# EAGLE design LEVELSHIFTER_REV01 (EAGLE 9.2.2)
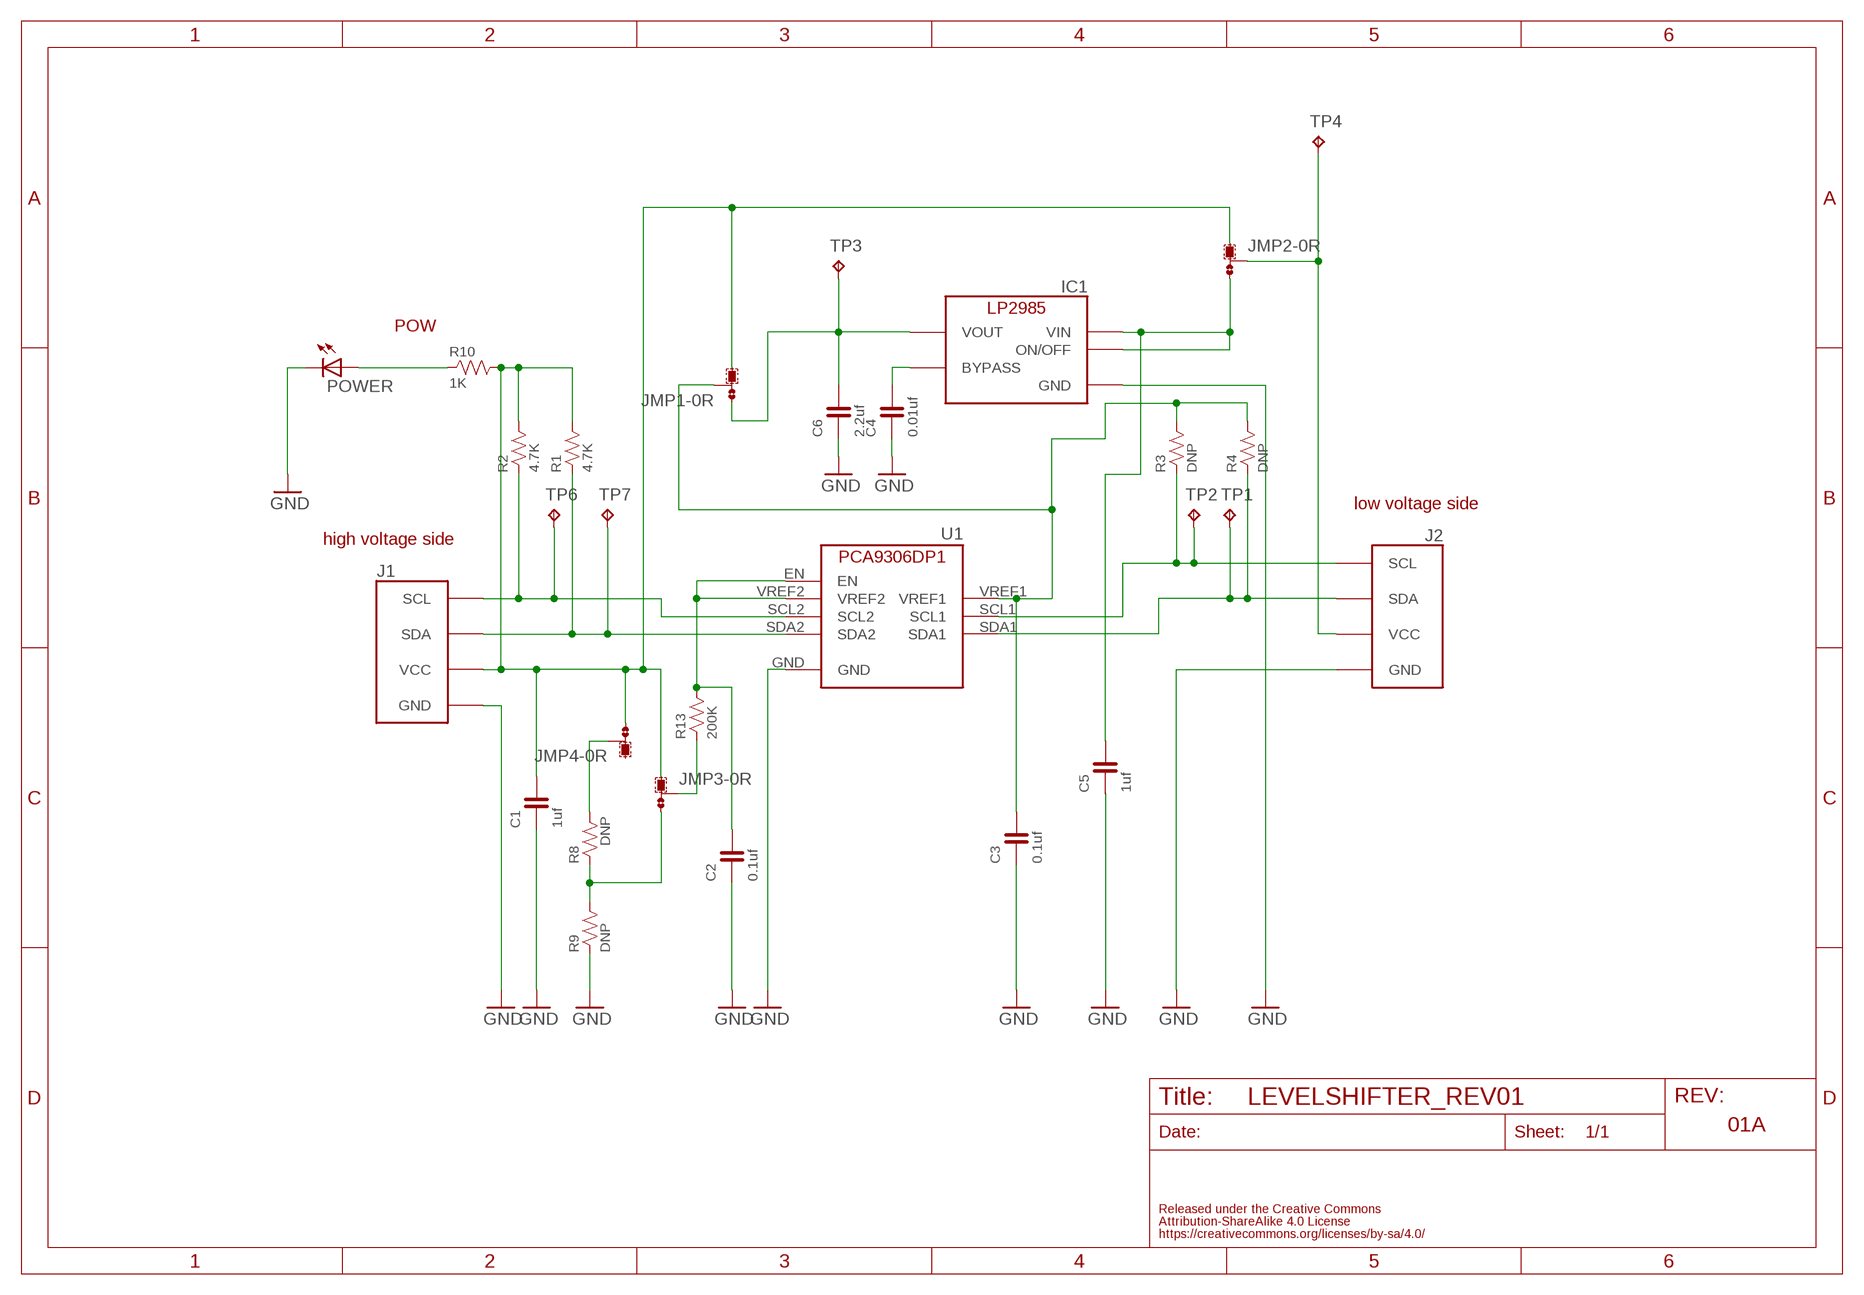
[diagram p0: schematic, sheet 1]

## Parts
C1  1uf  CAPACITOR-0603  [0603]
C2  0.1uf  CAPACITOR-0603  [0603]
C3  0.1uf  CAPACITOR-0603  [0603]
C4  0.01uf  CAPACITOR-0603  [0603]
C5  1uf  CAPACITOR-0603  [0603]
C6  2.2uf  CAPACITOR-0603  [0603]
IC1  LP2985-33DBV  [SOT-23-5]
J1  FABO_BRICK_I2C-S04B-PASK-2  [FABO_BRICK_I2C_S04B-PASK-2]
J2  FABO_BRICK_I2C-S04B-PASK-2  [FABO_BRICK_I2C_S04B-PASK-2]
JMP1  0R-JUMPA  [A0R-JMP]
JMP2  0R-JUMPA  [A0R-JMP]
JMP3  0R-JUMPA  [A0R-JMP]
JMP4  0R-JUMPA  [A0R-JMP]
POWER  LEDCHIPLED_0603  [CHIPLED_0603]
R1  4.7K  RESISTOR-0603  [0603]
R2  4.7K  RESISTOR-0603  [0603]
R3  DNP  RESISTOR-0603  [0603]
R4  DNP  RESISTOR-0603  [0603]
R8  DNP  RESISTOR-0603  [0603]
R9  DNP  RESISTOR-0603  [0603]
R10  1K  RESISTOR-0603  [0603]
R13  200K  RESISTOR-0603  [0603]
TP1  TPTP11R  [TP11R]
TP2  TPTP11R  [TP11R]
TP3  TPTP11R  [TP11R]
TP4  TPTP11R  [TP11R]
TP6  TPTP11R  [TP11R]
TP7  TPTP11R  [TP11R]
U1  PCA9306DP1  [TSSOP8]

## Nets
GND: C1.1 C2.1 C3.1 C4.1 C5.1 C6.1 IC1.2(GND) J1.GND J2.GND POWER.C R9.1 U1.GND
N$1: J1.SDA R1.1 TP7.TP U1.SDA2
N$2: J1.SCL R2.1 TP6.TP U1.SCL2
N$3: C2.2 R13.2 U1.EN U1.VREF2
N$4: JMP3.3 R8.1 R9.2
N$7: J2.SCL R3.1 TP2.TP U1.SCL1
N$8: J2.SDA R4.1 TP1.TP U1.SDA1
N$9: C3.2 JMP1.2 R3.2 R4.2 U1.VREF1
N$10: C5.2 IC1.1(VIN) IC1.3(ON/OFF) JMP2.3
N$13: JMP4.2 R8.2
N$18: C6.2 IC1.5(VOUT) JMP1.1 TP3.TP
N$19: JMP3.2 R13.1
N$20: C4.2 IC1.4(BYPASS)
N$21: J2.VCC JMP2.2 TP4.TP
N$27: POWER.A R10.1
VCC: C1.2 J1.VCC JMP1.3 JMP2.1 JMP3.1 JMP4.3 R1.2 R2.2 R10.2
Unconnected: JMP4.1

## Notes on the sheet
- POW
- low voltage side
- high voltage side
- 01A

## Library data of the parts
C1-C6 = FaBo-Capacitor:CAPACITOR: CAPACITOR
IC1 = FaBo-Supply:LP2985: LP2985
J1 J2 = FaBo-Template 2:FABO_BRICK_I2C: FaBo Brick I2C
JMP1-JMP4 = jump-0r-smd:0R-JUMP: SMD 0R 0805 Jumper
POWER = led:LED: LED OSRAM: - CHIPLED LG R971, LG N971, LY N971, LG Q971, LY Q971, LO R971, LY R971 LH N974, LH R974 LS Q976, LO Q976, LY Q976 LO Q996 - Hyper CHIPLED LW Q18S LB Q993, LB Q99A, LB R99A - SideLED LS A670, LO A670, LY A670, LG A670, LP A670 LB A673, LV A673, LT A673, LW A673 LH A674 LY A675 LS A676, LA A676, LO A676, LY A676, LW A676 LS A679, LY A679, LG A679 - Hyper Micro SIDELED® LS Y876, LA Y876, LO Y876, LY Y876 LT Y87S - SmartLED LW L88C, LW L88S LB L89C, LB L89S, LG L890 LS L89K, LO L89K, LY L89K LS L896, LA L896, LO L896, LY L896 - TOPLED LS T670, LO T670, LY T670, LG T670, LP T670 LSG T670, LSP T670, LSY T670, LOP T670, LYG T670 LG T671, LOG T671, LSG T671 LB T673, LV T673, LT T673, LW T673 LH T674 LS T676, LA T676, LO T676, LY T676, LB T676, LH T676, LSB T676, LW T676 LB T67C, LV T67C, LT T67C, LS T67K, LO T67K, LY T67K, LW E67C LS E67B, LA E67B, LO E67B, LY E67B, LB E67C, LV E67C, LT E67C LW T67C LS T679, LY T679, LG T679 LS T770, LO T770, LY T770, LG T770, LP T770 LB T773, LV T773, LT T773, LW T773 LH T774 LS E675, LA E675, LY E675, LS T675 LS T776, LA T776, LO T776, LY T776, LB T776 LHGB T686 LT T68C, LB T68C - Hyper Mini TOPLED® LB M676 - Mini TOPLED Santana® LG M470 LS M47K, LO M47K, LY M47K Source: http://www.osram.convergy.de LUXEON: - LUMILED® LXK2-PW12-R00, LXK2-PW12-S00, LXK2-PW14-U00, LXK2-PW14-V00 LXK2-PM12-R00, LXK2-PM12-S00, LXK2-PM14-U00 LXK2-PE12-Q00, LXK2-PE12-R00, LXK2-PE12-S00, LXK2-PE14-T00, LXK2-PE14-U00 LXK2-PB12-K00, LXK2-PB12-L00, LXK2-PB12-M00, LXK2-PB14-N00, LXK2-PB14-P00, LXK2-PB14-Q00 LXK2-PR12-L00, LXK2-PR12-M00, LXK2-PR14-Q00, LXK2-PR14-R00 LXK2-PD12-Q00, LXK2-PD12-R00, LXK2-PD12-S00 LXK2-PH12-R00, LXK2-PH12-S00 LXK2-PL12-P00, LXK2-PL12-Q00, LXK2-PL12-R00 Source: www.luxeon.com KINGBRIGHT: KA-3528ASYC Source: www.kingbright.com
R1-R4 R8-R10 R13 = FaBo-Resistors:RESISTOR: RESISTOR
TP1-TP4 TP6 TP7 = testpad:TP: Test pad
U1 = FaBo-LevelTranslator:PCA9306DP1

## Board
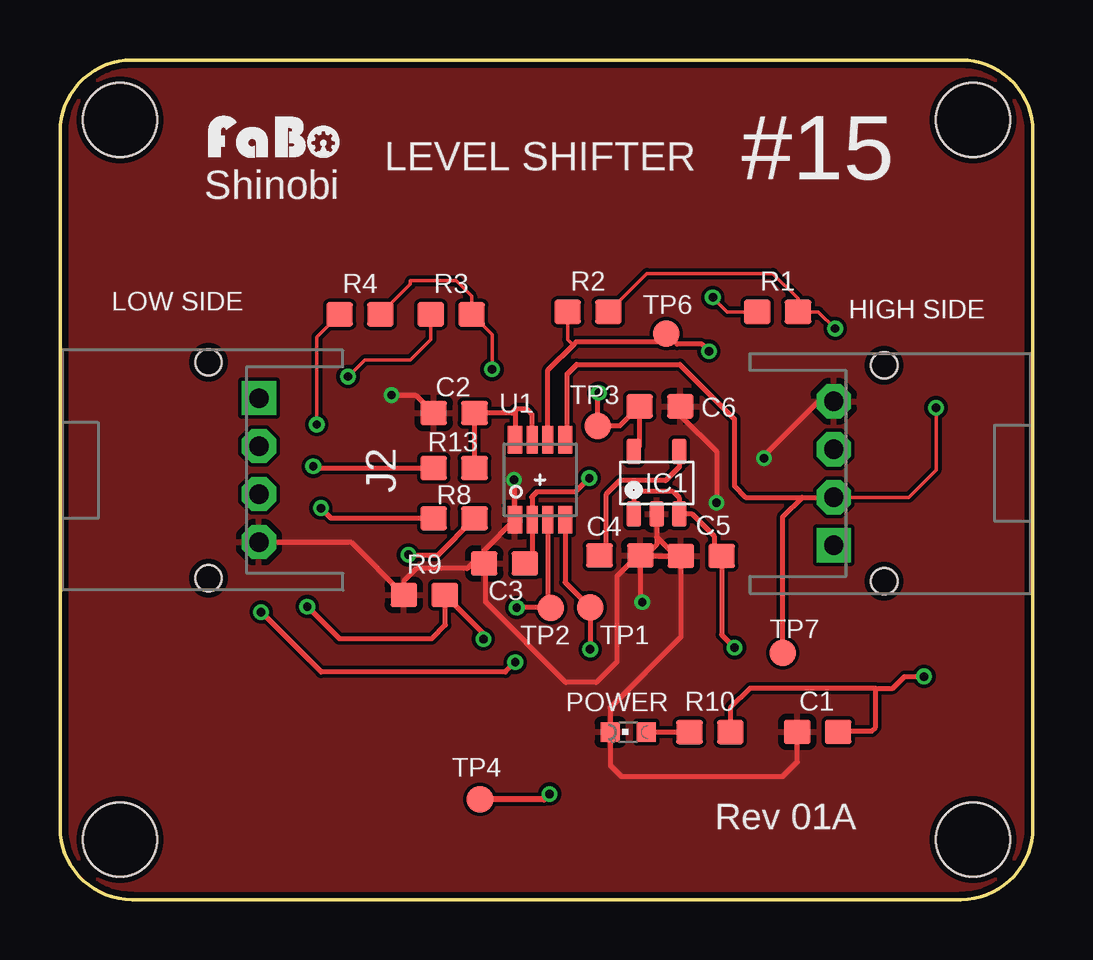
[diagram p1: board, top side]
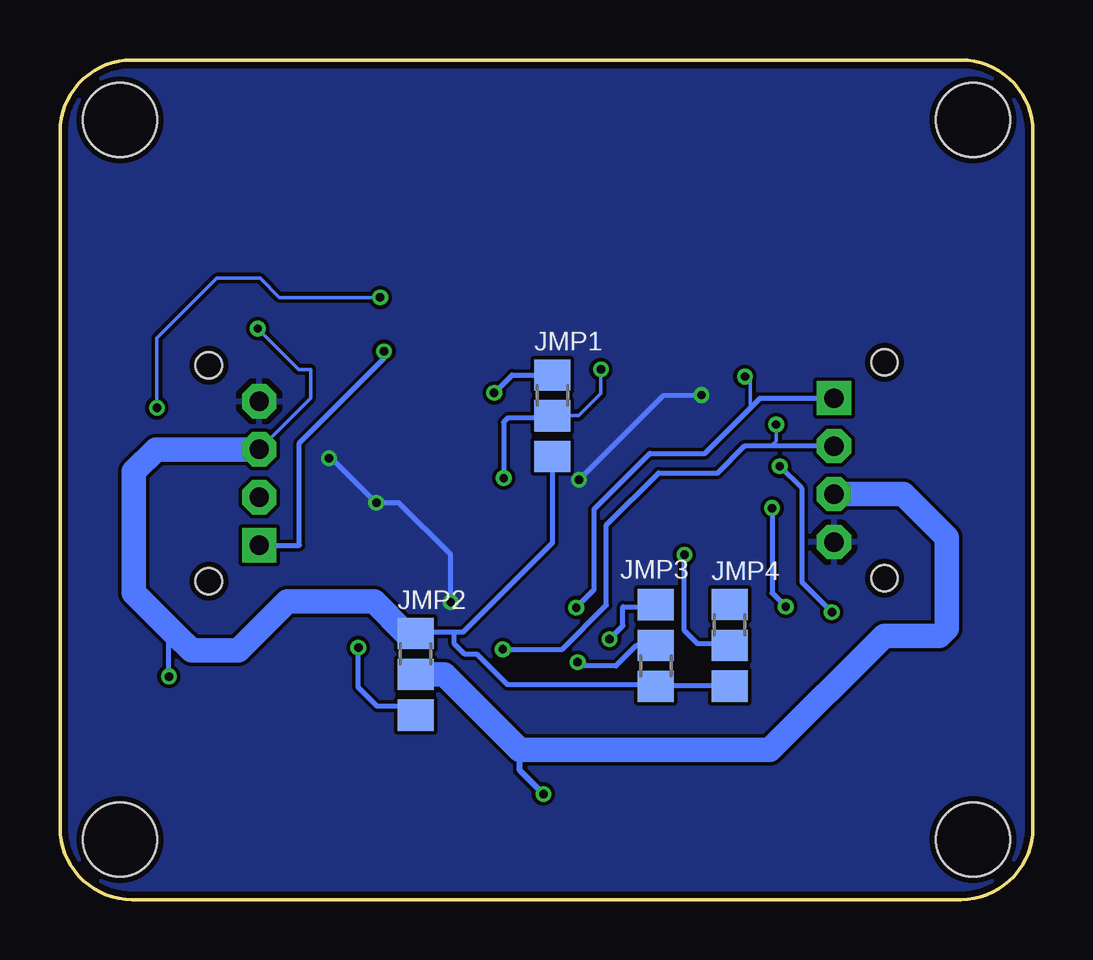
[diagram p2: board, bottom side, seen from below]

Size 40.54 x 35 mm. Coordinates in mm from the lower left corner, seen from the top.
Copper layers (1*16): Top 0.035mm / dielectric 1.5mm / Bottom 0.035mm
Design rules "SeeedStudio_2layer_DRU_no_angle_20140221": minimum track width 6mil, minimum drill 12mil, track to track 6mil, track to pad 6mil, pad to pad 6mil, via to via 6mil, smd to smd 0mil, copper to edge 10mil, drill to drill 10mil, minimum pad ring 10mil, minimum via ring 6mil, stop-mask expansion 2mil, vias tented up to drill 100mil, thermal gap 10mil

### Footprints (pad centres in the part's own frame; a part is rotated, then mirrored left to right if it is on the bottom)
0603 = smd 1.1 x 1: 1 -0.85,0; 2 0.85,0
SOT-23-5 = smd 0.6 x 1.05: 1 -0.95,-1.3; 2 0,-1.3; 3 0.95,-1.3; 4 0.95,1.3; 5 -0.95,1.3
FABO_BRICK_I2C_S04B-PASK-2 = drill 0.8 pad 1.422 octagon: GND -3,0; SDA 1,0; VCC -1,0 | drill 0.8 pad 1.422 square: SCL 3,0 | hole 1.1: 4.5,2.1; -4.5,2.1
A0R-JMP = smd 1.5 x 1.3: 1 0,1.7; 2 0,0; 3 0,-1.7
CHIPLED_0603 = smd 0.8 x 0.8: A 0,-0.75; C 0,0.75
TP11R = smd 1.1 x 1.1: TP 0,0
TSSOP8 = smd 0.6 x 1.15: EN -1.05,1.663; GND -1.05,-1.663; SDA1 1.05,-1.663; SDA2 1.05,1.663 | smd 0.45 x 1.15: SCL1 0.325,-1.663; SCL2 0.325,1.663; VREF1 -0.325,-1.663; VREF2 -0.325,1.663
FABO-SHINOBI = hole 3.1: 2.5,32.5; 38.04,32.5; 38.04,2.5; 2.5,2.5

### Placement (x,y rotation side)
C1  31.57,6.99 0 top
C2  16.42,20.28 0 top
C3  18.52,14.01 0 top
C4  23.33,14.34 180 top
C5  26.72,14.32 0 top
C6  25,20.56 180 top
IC1  24.86,17.37 0 top
J1  32.24,17.77 270 top
J2  8.29,17.9 90 top
JMP1  20.02,20.17 0 bottom
JMP2  25.72,9.39 0 bottom
JMP3  15.71,10.59 180 bottom
JMP4  12.64,10.6 0 bottom
POWER  23.68,6.98 90 top
R1  29.9,24.5 0 top
R2  22,24.5 0 top
R3  16.3,24.4 0 top
R4  12.5,24.4 0 top
R8  16.42,15.89 0 top
R9  15.18,12.7 0 top
R10  27.08,6.98 0 top
R13  16.42,17.99 0 top
TP1  22.1,12.17 0 top
TP2  20.45,12.15 0 top
TP3  22.41,19.74 0 top
TP4  17.5,4.17 0 top
TP6  25.26,23.6 0 top
TP7  30.12,10.29 0 top
U1  20,17.5 0 top
U$1  [LOGO_FABO_S]  8.97,30.77 0 top
U$2  [FABO-SHINOBI]  0,0 0 top

### Tracks (layer width: path | path; a pad name or v marks a point on that pad's centre or on a via)
GND  (via drill 0.35)
  Top 0.2: C4.1 24.2,14.32 24.39,14.32 | 24.39,14.32 25.65,14.32 | 25.65,14.32 C5.1 25.87,10.95 22.92,8 POWER.C 22.93,5.59 23.39,5.13 30.12,5.13 30.72,5.73 C1.1 | IC1.2 24.86,14.79 24.39,14.32 | IC1.2 24.86,15.11 25.65,14.32 | C6.1 25.85,20.18 27.36,18.67 v27.36,16.54 | 24.86,16.29 IC1.2 | C3.1 17.42,14.26 16.96,13.8 14.85,13.8 14.33,13.28 R9.1 12.13,14.9 J2.GND | C3.1 17.67,14.56 U1.GND 18.95,17.46 v18.92,17.5 | v29.33,18.39 29.33,18.5 31.6,20.77 J1.GND | C4.1 24.18,12.48 v24.26,12.4 | v13.81,21.03 14.82,21.03 C2.1 | C4.1 24.07,14.34 23.2,13.47 23.2,9.91 22.34,9.05 21.08,9.05 17.73,12.4 17.73,13.95 C3.1
  Bottom 0.2: v29.33,18.39 29.21,18.39 v27.36,16.54 26.42,16.54 24.26,14.38 v24.26,12.4 | v18.92,17.5 15.38,21.03 v13.81,21.03
  pour Bottom: 0.2,35.6 40.6,35.6 40.6,-0.4 0.2,-0.4
  pour Top: 0.2,35.6 40.6,35.6 40.6,-0.4 0.2,-0.4
N$1  (via drill 0.35)
  Top 0.152: R1.1 27.8,24.5 v27.2,25.1 | v36.5,20.5 36.5,17.9 35.37,16.77 32.2,16.77
  Top 0.2: U1.SDA2 21.13,19.24 21.13,21.91 21.53,22.31 25.83,22.31 28.1,20.04 28.1,17.23 28.56,16.77 30.92,16.77 | 30.92,16.77 32.2,16.77 J1.SDA | TP7.TP 30.12,15.97 30.92,16.77
  Bottom 0.152: v27.2,25.1 31.4,25.1 32.2,25.9 34,25.9 36.5,23.4 v36.5,20.5
N$2  (via drill 0.35)
  Top 0.152: R2.1 21.15,23.35 21.38,23.12
  Top 0.2: v27.04,22.86 26.75,23.15 25.71,23.15 TP6.TP 24.9,23.24 21.49,23.24 21.38,23.12 20.32,22.07 U1.SCL2
  Bottom 0.2: J1.SCL 30.57,14.77 30.57,19.04 27.04,22.57 v27.04,22.86
N$3
  Top 0.2: U1.VREF2 19.68,20.23 19.46,20.44 18.99,20.44 18.97,20.42 | 18.97,20.42 18.97,19.18 U1.EN | 18.97,20.42 18.83,20.28 C2.2 R13.2
N$4  (via drill 0.35)
  Top 0.2: R9.2 16.06,12.67 | 16.06,12.67 17.64,11.09 v17.64,10.86 | R8.1 11.3,15.89 v10.87,16.32 | v10.3,12.21 11.63,10.88 15.5,10.88 16.06,11.44 16.06,12.67
  Bottom 0.2: v17.64,10.86 17.09,11.41 17.09,12.2 15.8,12.2 JMP3.3 | v10.87,16.32 10.87,12.78 v10.3,12.21
N$7  (via drill 0.35)
  Top 0.152: R3.1 15.45,23.35 14.6,22.5 12.7,22.5 v12,21.8
  Top 0.2: U1.SCL1 20.32,12.28 TP2.TP 20.43,12.17 v19.03,12.17
  Bottom 0.152: v12,21.8 11.79,21.59 11.79,20.48
  Bottom 0.2: v19.03,12.17 18.28,12.92 18.28,16.28 15.96,18.6 13.67,18.6 11.79,20.48 11.37,20.9 J2.SCL
N$8  (via drill 0.35)
  Top 0.152: R4.1 10.7,23.45 v10.7,19.8
  Top 0.2: U1.SDA1 21.05,13.22 TP1.TP v22.09,10.43
  Bottom 0.152: v10.7,19.8 10.7,19.12 10.9,18.92
  Bottom 0.2: v22.09,10.43 19.62,10.43 17.77,12.28 17.77,15.62 15.6,17.79 13.13,17.79 12,18.92 10.9,18.92 8.31,18.92 J2.SDA
N$9  (via drill 0.35)
  Top 0.152: R4.2 14.6,25.65 14.6,25.8 16.5,25.8 17.15,25.15 R3.2 18,23.55 v18,22.1
  Top 0.2: C3.2 19.68,14.31 U1.VREF1 19.68,16.75 19.65,16.78 19.86,16.99 21.47,16.99 v22.05,17.57
  Bottom 0.152: v18,22.1 18,21.1 18.93,20.17 JMP1.2
  Bottom 0.2: JMP1.2 20.11,20.08 21.88,20.08 22.06,19.9 v22.06,17.57 v22.05,17.57
N$10  (via drill 0.35)
  Top 0.2: v28.11,10.5 27.57,11.04 C5.2 27.28,14.61 27.28,15.13 26.34,16.07 IC1.3 25.8,16.76 25.53,17.03 24.19,17.03 23.93,16.77 23.93,16.09 IC1.1
  Bottom 0.2: JMP2.3 25.72,8.11 25.77,8.06 27.33,8.06 28.11,8.84 v28.11,10.5
N$13  (via drill 0.35)
  Top 0.2: v14.52,14.37 15.75,14.37 R8.2
  Bottom 0.2: JMP4.2 12.7,10.66 13.97,10.66 14.52,11.21 v14.52,14.37
N$18  (via drill 0.35)
  Top 0.2: IC1.5 24.14,18.9 C6.2 23.33,19.74 TP3.TP 22.41,21.08 v22.45,21.12
  Bottom 0.2: v22.45,21.12 21.7,21.87 JMP1.1
N$19  (via drill 0.35)
  Top 0.2: v18.97,9.89 18.56,9.48 10.88,9.48 v8.38,11.98 | v10.55,18.06 10.62,17.99 R13.1
  Bottom 0.2: JMP3.2 16.52,10.59 17.38,9.73 18.81,9.73 v18.97,9.89 | v8.38,11.98 9.62,13.22 9.62,17.13 v10.55,18.06
N$20
  Top 0.2: IC1.4 25.81,18.04 25.23,17.46 23.32,17.46 22.74,16.88 22.74,14.6 C4.2
N$21  (via drill 0.35)
  Top 0.254: v20.4,4.4 20.17,4.17 TP4.TP
  Bottom 0.254: v20.4,4.4 21.38,5.38 21.38,6.23
  Bottom 1.016: JMP2.2 24.54,9.39 21.38,6.23 10.97,6.23 6.2,11 3.9,11 3.6,11.3 3.6,15.1 5.4,16.9 J2.VCC
N$27
  Top 0.2: POWER.A R10.1
VCC  (via drill 0.35)
  Top 0.152: R2.2 24.45,26.1 29.7,26.1 30.75,25.05 R1.2 31.6,24.5 v32.3,23.8
  Top 0.2: R10.2 27.93,7.99 28.75,8.81 33.98,8.81 | 33.98,8.81 34.7,8.81 35.19,9.3 v36,9.3 | C1.2 32.46,7.03 33.83,7.03 33.98,7.18 33.98,8.81
  Bottom 0.152: J1.VCC 30.1,20.91 30.1,22.1 30.6,22.1 v32.3,23.8
  Bottom 0.2: JMP2.1 25.77,11.14 24.11,11.14 | JMP1.3 20.02,14.87 23.75,11.14 24.11,11.14 | JMP4.3 JMP3.1 15.77,8.95 21.89,8.95 23.16,10.22 23.67,10.22 24.11,10.66 24.11,11.14 | v36,9.3 36,10.75 35.71,11.04
  Bottom 1.016: 25.77,11.14 26.17,11.14 27.45,12.42 31.08,12.42 33.12,10.38 35.05,10.38 35.71,11.04 37.46,12.79 37.46,17.84 36.53,18.77 J1.VCC

### Text on the board
tPlace: LEVEL SHIFTER | #15 | Shinobi | LOW SIDE | HIGH SIDE | Rev 01A